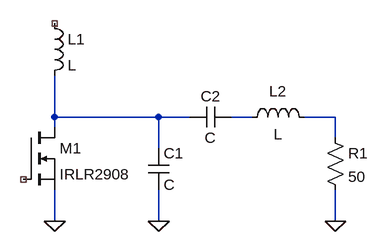
[diagram p0: schematic calss_e_pa.asc]
calss_e_pa.asc, the LTspice schematic file:
Version 4
SHEET 1 880 680
WIRE 112 144 112 80
WIRE 272 144 112 144
WIRE 320 144 272 144
WIRE 416 144 384 144
WIRE 544 144 496 144
WIRE 112 160 112 144
WIRE 544 176 544 144
WIRE 272 192 272 144
WIRE 112 304 112 256
WIRE 272 304 272 256
WIRE 544 304 544 256
FLAG 112 304 0
FLAG 272 304 0
FLAG 544 304 0
SYMBOL nmos 64 160 R0
SYMATTR InstName M1
SYMATTR Value IRLR2908
SYMBOL ind 96 -16 R0
SYMATTR InstName L1
SYMBOL ind 400 160 R270
WINDOW 0 40 56 VTop 2
WINDOW 3 5 56 VBottom 2
SYMATTR InstName L2
SYMBOL cap 256 192 R0
SYMATTR InstName C1
SYMBOL cap 384 128 R90
WINDOW 0 0 32 VBottom 2
WINDOW 3 32 32 VTop 2
SYMATTR InstName C2
SYMBOL res 528 160 R0
SYMATTR InstName R1
SYMATTR Value 50

The netlist it stands for:
* calss_e_pa.asc
M1 N001 NC_01 0 0 IRLR2908
L1 NC_02 N001 L
L2 N002 N003 L
C1 N001 0 C
C2 N002 N001 C
R1 N003 0 50
.model NMOS NMOS
.model PMOS PMOS
.lib standard.mos
.backanno
.end